# Altium schematic sheet PCB Ver. 1.0.SchDoc
size A3; PageSetup: Record=PageOptions|CenterHorizontal=True|CenterVertical=True|PrintScale=1.00|XCorrection=1.00|YCorrection=1.00|PrintKind=1|BorderSize=5000000|LeftOffset=0|BottomOffset=0|Orientation=2|PaperLength=1000|PaperWidth=1000|Scale=100|PaperSource=7|PrintQuality=-3|MediaType=1|DitherType=10|PrintScaleMode=1|PaperKind=A3|PaperIndex=8
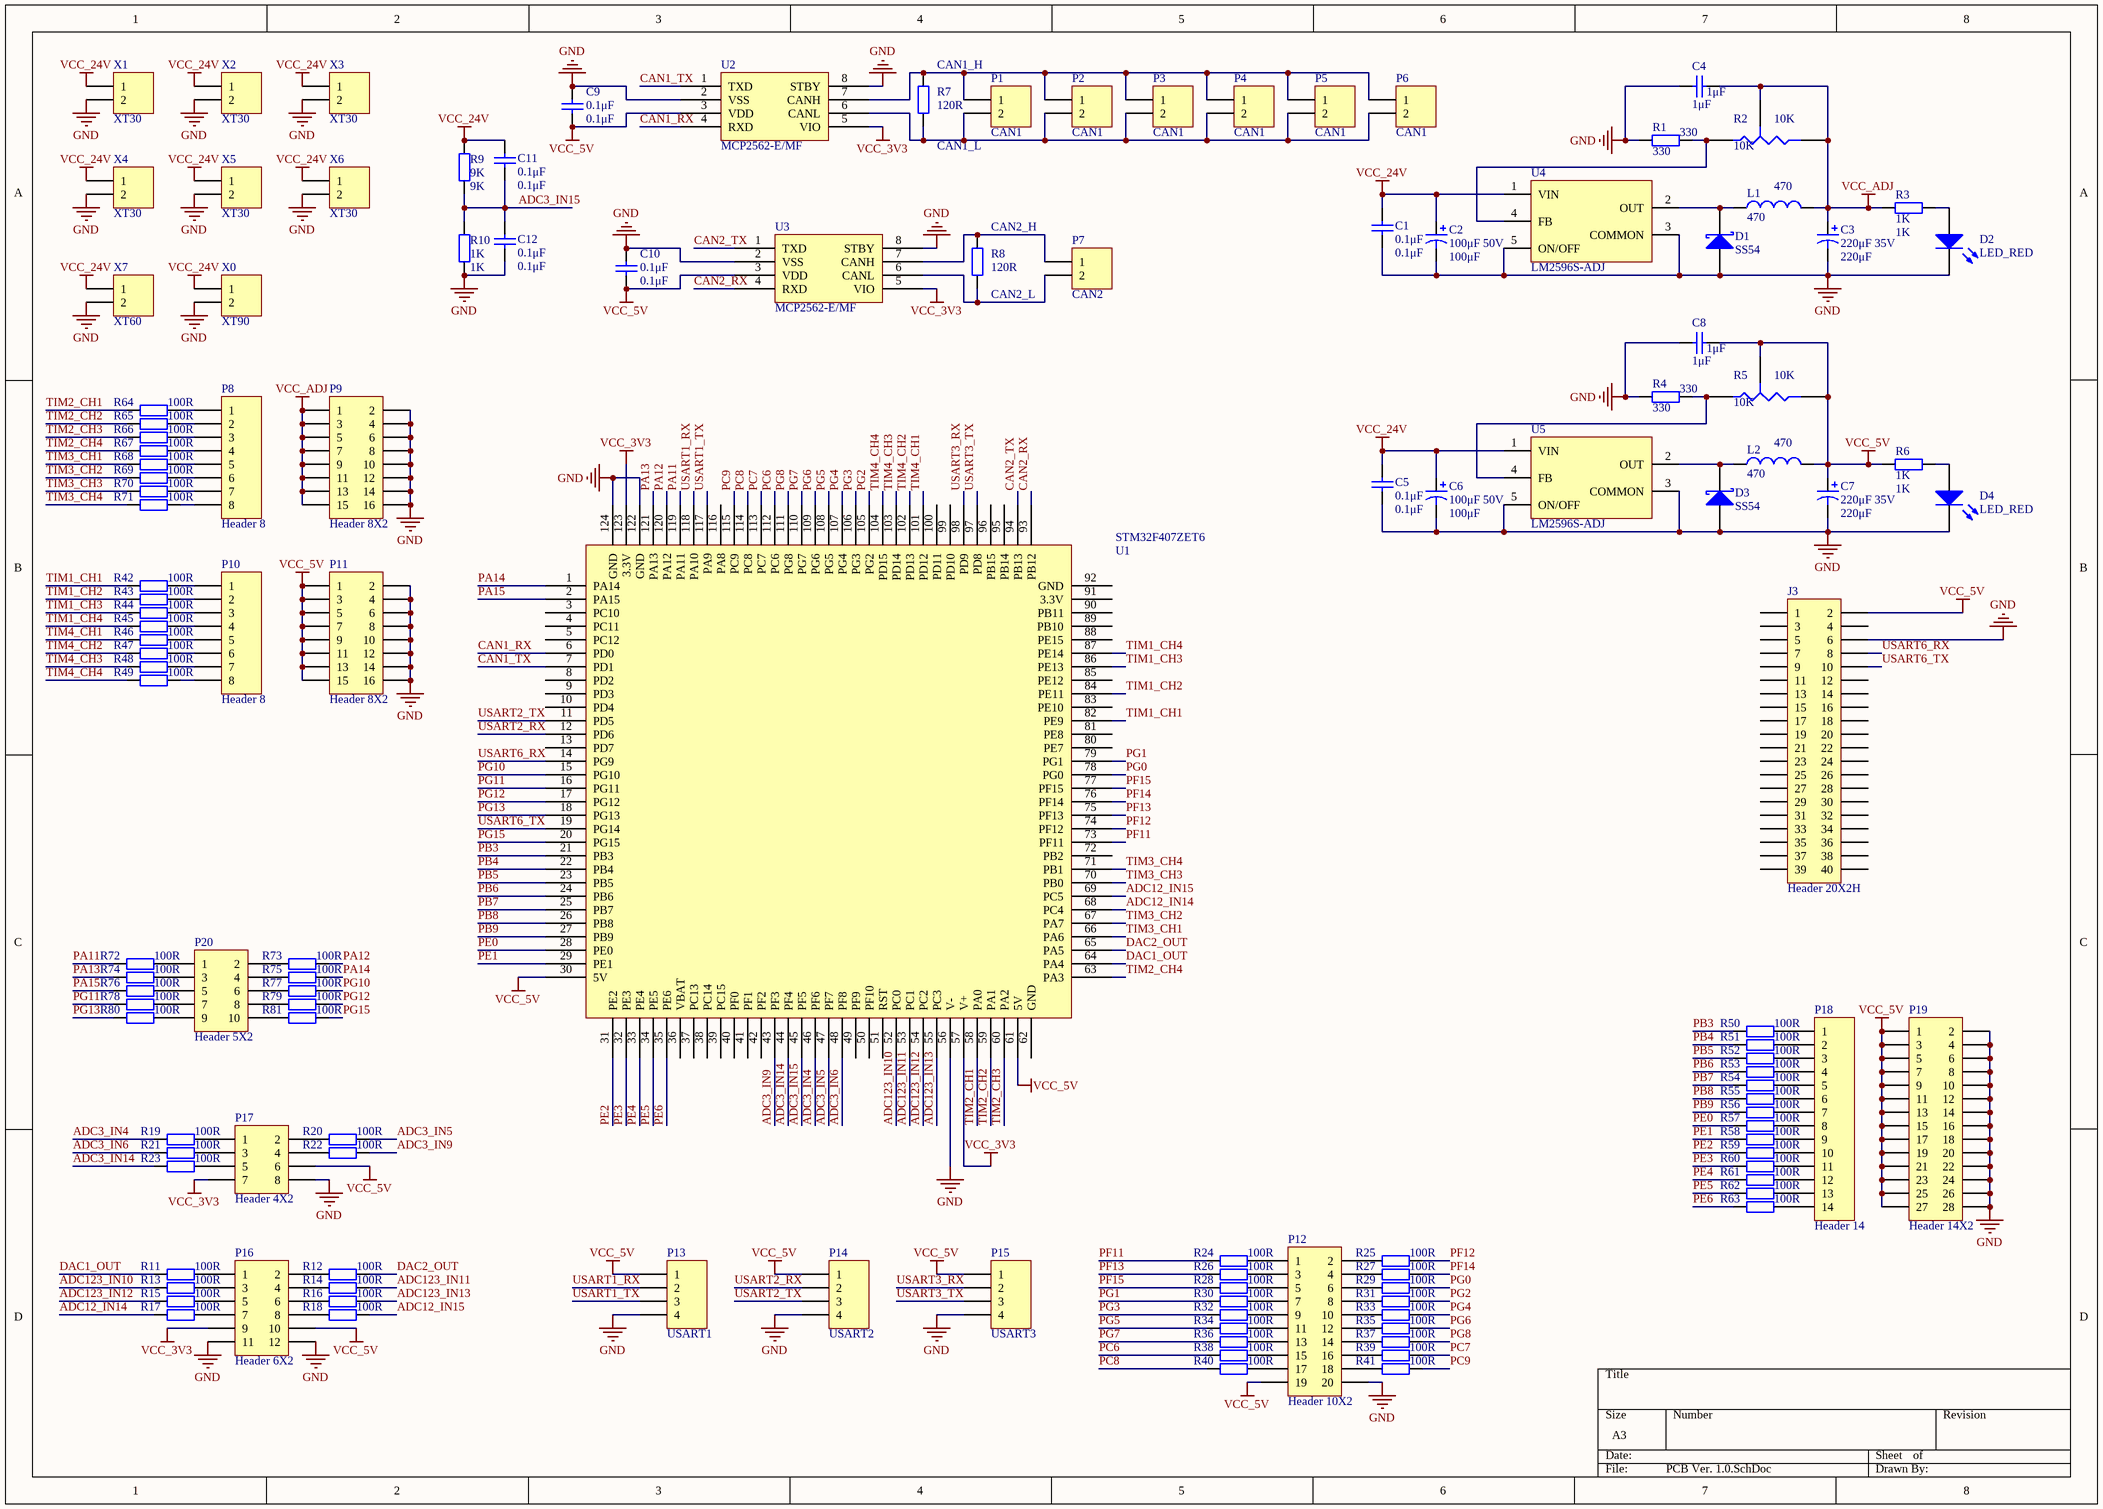
[diagram p0: PCB Ver. 1.0.SchDoc]

## Parts
C1  0.1μF  [6-0805_N]
C2  100μF 50V  value 100μF  [8*12直插铝电解]
C3  220μF 35V  value 220μF  [8*12直插铝电解]
C4  1μF  [6-0805_N]
C5  0.1μF  [6-0805_N]
C6  100μF 50V  value 100μF  [8*12直插铝电解]
C7  220μF 35V  value 220μF  [8*12直插铝电解]
C8  1μF  [6-0805_N]
C9  0.1μF  [6-0805_N]
C10  0.1μF  [6-0805_N]
C11  0.1μF  [6-0805_N]
C12  0.1μF  [6-0805_N]
D1  SS54  [DO-214AA]
D2  LED_RED  [1206_LED]
D3  SS54  [DO-214AA]
D4  LED_RED  [1206_LED]
J3  Header 20X2H  [HDR2X20]
L1  470  [12*12*7贴片电感]
L2  470  [12*12*7贴片电感]
P1  CAN1  [MHDR1X2]
P2  CAN1  [MHDR1X2]
P3  CAN1  [MHDR1X2]
P4  CAN1  [MHDR1X2]
P5  CAN1  [MHDR1X2]
P6  CAN1  [MHDR1X2]
P7  CAN2  [HDR1X2]
P8  Header 8  [HDR1X8]
P9  Header 8X2  [HDR2X8]
P10  Header 8  [HDR1X8]
P11  Header 8X2  [HDR2X8]
P12  Header 10X2  [HDR2X10]
P13  USART1  [HDR1X4]
P14  USART2  [HDR1X4]
P15  USART3  [HDR1X4]
P16  Header 6X2  [HDR2X6]
P17  Header 4X2  [HDR2X4]
P18  Header 14  [HDR1X14]
P19  Header 14X2  [HDR2X14]
P20  Header 5X2  [HDR2X5]
R1  330  [6-0805_N]
R2  10K  [3296W精密电位器]
R3  1K  [6-0805_N]
R4  330  [6-0805_N]
R5  10K  [3296W精密电位器]
R6  1K  [6-0805_N]
R7  120R  [6-0805_N]
R8  120R  [6-0805_N]
R9  9K  [6-0805_N]
R10  1K  [6-0805_N]
R11  100R  [6-0805_N]
R12  100R  [6-0805_N]
R13  100R  [6-0805_N]
R14  100R  [6-0805_N]
R15  100R  [6-0805_N]
R16  100R  [6-0805_N]
R17  100R  [6-0805_N]
R18  100R  [6-0805_N]
R19  100R  [6-0805_N]
R20  100R  [6-0805_N]
R21  100R  [6-0805_N]
R22  100R  [6-0805_N]
R23  100R  [6-0805_N]
R24  100R  [6-0805_N]
R25  100R  [6-0805_N]
R26  100R  [6-0805_N]
R27  100R  [6-0805_N]
R28  100R  [6-0805_N]
R29  100R  [6-0805_N]
R30  100R  [6-0805_N]
R31  100R  [6-0805_N]
R32  100R  [6-0805_N]
R33  100R  [6-0805_N]
R34  100R  [6-0805_N]
R35  100R  [6-0805_N]
R36  100R  [6-0805_N]
R37  100R  [6-0805_N]
R38  100R  [6-0805_N]
R39  100R  [6-0805_N]
R40  100R  [6-0805_N]
R41  100R  [6-0805_N]
R42  100R  [6-0805_N]
R43  100R  [6-0805_N]
R44  100R  [6-0805_N]
R45  100R  [6-0805_N]
R46  100R  [6-0805_N]
R47  100R  [6-0805_N]
R48  100R  [6-0805_N]
R49  100R  [6-0805_N]
R50  100R  [6-0805_N]
R51  100R  [6-0805_N]
R52  100R  [6-0805_N]
R53  100R  [6-0805_N]
R54  100R  [6-0805_N]
R55  100R  [6-0805_N]
R56  100R  [6-0805_N]
R57  100R  [6-0805_N]
R58  100R  [6-0805_N]
R59  100R  [6-0805_N]
R60  100R  [6-0805_N]
R61  100R  [6-0805_N]
R62  100R  [6-0805_N]
R63  100R  [6-0805_N]
R64  100R  [6-0805_N]
R65  100R  [6-0805_N]
R66  100R  [6-0805_N]
R67  100R  [6-0805_N]
R68  100R  [6-0805_N]
R69  100R  [6-0805_N]
R70  100R  [6-0805_N]
R71  100R  [6-0805_N]
R72  100R  [6-0805_N]
R73  100R  [6-0805_N]
R74  100R  [6-0805_N]
R75  100R  [6-0805_N]
R76  100R  [6-0805_N]
R77  100R  [6-0805_N]
R78  100R  [6-0805_N]
R79  100R  [6-0805_N]
R80  100R  [6-0805_N]
R81  100R  [6-0805_N]
STM32F407ZET6  U1  [STM32F103ZET6]
U2  MCP2562-E/MF  [SO-8]
U3  MCP2562-E/MF  [SO-8]
U4  LM2596S-ADJ  [TO-263]
U5  LM2596S-ADJ  [TO-263]
X0  XT90  [XT90PB]
X1  XT30  [XT30UPB]
X2  XT30  [XT30UPB]
X3  XT30  [XT30UPB]
X4  XT30  [XT30UPB]
X5  XT30  [XT30UPB]
X6  XT30  [XT30UPB]
X7  XT60  [XT60PB]

## Nets
GND: C1.1 C2.2 C3.2 C4.1 C5.1 C6.2 C7.2 C8.1 C9.2 C10.2 C12.1 D1.1(A) D2.2(K) D3.1(A) D4.2(K) J3.6 P9.2 P9.4 P9.6 P9.8 P9.10 P9.12 P9.14 P9.16 P11.2 P11.4 P11.6 P11.8 P11.10 P11.12 P11.14 P11.16 P12.20 P13.4 P14.4 P15.4 P16.11 P16.12 P17.8 P19.2 P19.4 P19.6 P19.8 P19.10 P19.12 P19.14 P19.16 P19.18 P19.20 P19.22 P19.24 P19.26 P19.28 R1.1 R4.1 R10.1 STM32F407ZET6.56(V-) STM32F407ZET6.122(GND) STM32F407ZET6.124(GND) U2.2(VSS) U2.8(STBY) U3.2(VSS) U3.8(STBY) U4.3(COMMON) U4.5(ON/OFF) U5.3(COMMON) U5.5(ON/OFF) X0.2 X1.2 X2.2 X3.2 X4.2 X5.2 X6.2 X7.2
VCC_3V3: P16.9 P17.7 STM32F407ZET6.57(V+) STM32F407ZET6.123(3.3V) U2.5(VIO) U3.5(VIO)
VCC_5V: C7.1 C8.2 C9.1 C10.1 J3.2 L2.2 P11.1 P11.3 P11.5 P11.7 P11.9 P11.11 P11.13 P11.15 P12.19 P13.1 P14.1 P15.1 P16.10 P17.6 P19.1 P19.3 P19.5 P19.7 P19.9 P19.11 P19.13 P19.15 P19.17 P19.19 P19.21 P19.23 P19.25 P19.27 R5.2(B) R5.3(TAP) R6.1 STM32F407ZET6.30(5V) STM32F407ZET6.61(5V) U2.3(VDD) U3.3(VDD)
VCC_24V: C1.2 C2.1 C5.2 C6.1 C11.2 R9.2 U4.1(VIN) U5.1(VIN) X0.1 X1.1 X2.1 X3.1 X4.1 X5.1 X6.1 X7.1
VCC_ADJ: C3.1 C4.2 L1.2 P9.1 P9.3 P9.5 P9.7 P9.9 P9.11 P9.13 P9.15 R2.2(B) R2.3(TAP) R3.1
ADC3_IN4: R19.1 STM32F407ZET6.46(PF6)
ADC3_IN5: R20.2 STM32F407ZET6.47(PF7)
ADC3_IN6: R21.1 STM32F407ZET6.48(PF8)
ADC3_IN9: R22.2 STM32F407ZET6.43(PF3)
ADC3_IN14: R23.1 STM32F407ZET6.44(PF4)
ADC3_IN15: C11.1 C12.2 R9.1 R10.2 STM32F407ZET6.45(PF5)
ADC12_IN14: R17.1 STM32F407ZET6.68(PC4)
ADC12_IN15: R18.2 STM32F407ZET6.69(PC5)
ADC123_IN10: R13.1 STM32F407ZET6.52(PC0)
ADC123_IN11: R14.2 STM32F407ZET6.53(PC1)
ADC123_IN12: R15.1 STM32F407ZET6.54(PC2)
ADC123_IN13: R16.2 STM32F407ZET6.55(PC3)
CAN1_RX: STM32F407ZET6.6(PD0) U2.4(RXD)
CAN1_TX: STM32F407ZET6.7(PD1) U2.1(TXD)
CAN2_RX: STM32F407ZET6.93(PB12) U3.4(RXD)
CAN2_TX: STM32F407ZET6.94(PB13) U3.1(TXD)
DAC1_OUT: R11.1 STM32F407ZET6.64(PA4)
DAC2_OUT: R12.2 STM32F407ZET6.65(PA5)
PA11: R72.1 STM32F407ZET6.119(PA11)
PA12: R73.2 STM32F407ZET6.120(PA12)
PA13: R74.1 STM32F407ZET6.121(PA13)
PA14: R75.2 STM32F407ZET6.1(PA14)
PA15: R76.1 STM32F407ZET6.2(PA15)
PB3: R50.1 STM32F407ZET6.21(PB3)
PB4: R51.1 STM32F407ZET6.22(PB4)
PB5: R52.1 STM32F407ZET6.23(PB5)
PB6: R53.1 STM32F407ZET6.24(PB6)
PB7: R54.1 STM32F407ZET6.25(PB7)
PB8: R55.1 STM32F407ZET6.26(PB8)
PB9: R56.1 STM32F407ZET6.27(PB9)
PC6: R38.1 STM32F407ZET6.112(PC6)
PC7: R39.2 STM32F407ZET6.113(PC7)
PC8: R40.1 STM32F407ZET6.114(PC8)
PC9: R41.2 STM32F407ZET6.115(PC9)
PE0: R57.1 STM32F407ZET6.28(PE0)
PE1: R58.1 STM32F407ZET6.29(PE1)
PE2: R59.1 STM32F407ZET6.31(PE2)
PE3: R60.1 STM32F407ZET6.32(PE3)
PE4: R61.1 STM32F407ZET6.33(PE4)
PE5: R62.1 STM32F407ZET6.34(PE5)
PE6: R63.1 STM32F407ZET6.35(PE6)
PF11: R24.1 STM32F407ZET6.73(PF11)
PF12: R25.2 STM32F407ZET6.74(PF12)
PF13: R26.1 STM32F407ZET6.75(PF13)
PF14: R27.2 STM32F407ZET6.76(PF14)
PF15: R28.1 STM32F407ZET6.77(PF15)
PG0: R29.2 STM32F407ZET6.78(PG0)
PG1: R30.1 STM32F407ZET6.79(PG1)
PG2: R31.2 STM32F407ZET6.105(PG2)
PG3: R32.1 STM32F407ZET6.106(PG3)
PG4: R33.2 STM32F407ZET6.107(PG4)
PG5: R34.1 STM32F407ZET6.108(PG5)
PG6: R35.2 STM32F407ZET6.109(PG6)
PG7: R36.1 STM32F407ZET6.110(PG7)
PG8: R37.2 STM32F407ZET6.111(PG8)
PG10: R77.2 STM32F407ZET6.15(PG10)
PG11: R78.1 STM32F407ZET6.16(PG11)
PG12: R79.2 STM32F407ZET6.17(PG12)
PG13: R80.1 STM32F407ZET6.18(PG13)
PG15: R81.2 STM32F407ZET6.20(PG15)
TIM1_CH1: R42.1 STM32F407ZET6.82(PE9)
TIM1_CH2: R43.1 STM32F407ZET6.84(PE11)
TIM1_CH3: R44.1 STM32F407ZET6.86(PE13)
TIM1_CH4: R45.1 STM32F407ZET6.87(PE14)
TIM2_CH1: R64.1 STM32F407ZET6.58(PA0)
TIM2_CH2: R65.1 STM32F407ZET6.59(PA1)
TIM2_CH3: R66.1 STM32F407ZET6.60(PA2)
TIM2_CH4: R67.1 STM32F407ZET6.63(PA3)
TIM3_CH1: R68.1 STM32F407ZET6.66(PA6)
TIM3_CH2: R69.1 STM32F407ZET6.67(PA7)
TIM3_CH3: R70.1 STM32F407ZET6.70(PB0)
TIM3_CH4: R71.1 STM32F407ZET6.71(PB1)
TIM4_CH1: R46.1 STM32F407ZET6.101(PD12)
TIM4_CH2: R47.1 STM32F407ZET6.102(PD13)
TIM4_CH3: R48.1 STM32F407ZET6.103(PD14)
TIM4_CH4: R49.1 STM32F407ZET6.104(PD15)
USART1_RX: P13.2 STM32F407ZET6.118(PA10)
USART1_TX: P13.3 STM32F407ZET6.117(PA9)
USART2_RX: P14.2 STM32F407ZET6.12(PD6)
USART2_TX: P14.3 STM32F407ZET6.11(PD5)
USART3_RX: P15.2 STM32F407ZET6.98(PD9)
USART3_TX: P15.3 STM32F407ZET6.97(PD8)
USART6_RX: J3.8 STM32F407ZET6.14(PG9)
USART6_TX: J3.10 STM32F407ZET6.19(PG14)
NetD1_2: D1.2(K) L1.1 U4.2(OUT)
NetD2_1: D2.1(A) R3.2
NetD3_2: D3.2(K) L2.1 U5.2(OUT)
NetD4_1: D4.1(A) R6.2
NetP1_1: P1.1 P2.1 P3.1 P4.1 P5.1 P6.1 R7.2 U2.7(CANH)
NetP1_2: P1.2 P2.2 P3.2 P4.2 P5.2 P6.2 R7.1 U2.6(CANL)
NetP7_1: P7.1 R8.2 U3.7(CANH)
NetP7_2: P7.2 R8.1 U3.6(CANL)
NetP8_1: P8.1 R64.2
NetP8_2: P8.2 R65.2
NetP8_3: P8.3 R66.2
NetP8_4: P8.4 R67.2
NetP8_5: P8.5 R68.2
NetP8_6: P8.6 R69.2
NetP8_7: P8.7 R70.2
NetP8_8: P8.8 R71.2
NetP10_1: P10.1 R42.2
NetP10_2: P10.2 R43.2
NetP10_3: P10.3 R44.2
NetP10_4: P10.4 R45.2
NetP10_5: P10.5 R46.2
NetP10_6: P10.6 R47.2
NetP10_7: P10.7 R48.2
NetP10_8: P10.8 R49.2
NetP12_1: P12.1 R24.2
NetP12_2: P12.2 R25.1
NetP12_3: P12.3 R26.2
NetP12_4: P12.4 R27.1
NetP12_5: P12.5 R28.2
NetP12_6: P12.6 R29.1
NetP12_7: P12.7 R30.2
NetP12_8: P12.8 R31.1
NetP12_9: P12.9 R32.2
NetP12_10: P12.10 R33.1
NetP12_11: P12.11 R34.2
NetP12_12: P12.12 R35.1
NetP12_13: P12.13 R36.2
NetP12_14: P12.14 R37.1
NetP12_15: P12.15 R38.2
NetP12_16: P12.16 R39.1
NetP12_17: P12.17 R40.2
NetP12_18: P12.18 R41.1
NetP16_1: P16.1 R11.2
NetP16_2: P16.2 R12.1
NetP16_3: P16.3 R13.2
NetP16_4: P16.4 R14.1
NetP16_5: P16.5 R15.2
NetP16_6: P16.6 R16.1
NetP16_7: P16.7 R17.2
NetP16_8: P16.8 R18.1
NetP17_1: P17.1 R19.2
NetP17_2: P17.2 R20.1
NetP17_3: P17.3 R21.2
NetP17_4: P17.4 R22.1
NetP17_5: P17.5 R23.2
NetP18_1: P18.1 R50.2
NetP18_2: P18.2 R51.2
NetP18_3: P18.3 R52.2
NetP18_4: P18.4 R53.2
NetP18_5: P18.5 R54.2
NetP18_6: P18.6 R55.2
NetP18_7: P18.7 R56.2
NetP18_8: P18.8 R57.2
NetP18_9: P18.9 R58.2
NetP18_10: P18.10 R59.2
NetP18_11: P18.11 R60.2
NetP18_12: P18.12 R61.2
NetP18_13: P18.13 R62.2
NetP18_14: P18.14 R63.2
NetP20_1: P20.1 R72.2
NetP20_2: P20.2 R73.1
NetP20_3: P20.3 R74.2
NetP20_4: P20.4 R75.1
NetP20_5: P20.5 R76.2
NetP20_6: P20.6 R77.1
NetP20_7: P20.7 R78.2
NetP20_8: P20.8 R79.1
NetP20_9: P20.9 R80.2
NetP20_10: P20.10 R81.1
NetR1_2: R1.2 R2.1(A) U4.4(FB)
NetR4_2: R4.2 R5.1(A) U5.4(FB)

Not connected (* = marked no-connect by the designer): J3 1 3 4 5 7 9 11 12 13 14 15 16 17 18 19 20 21 22 23 24 25 26 27 28 29 30 31 32 33 34 35 36 37 38 39 40; STM32F407ZET6 3(PC10) 4(PC11) 5(PC12) 8(PD2) 9(PD3) 10(PD4) 13(PD7) 36(VBAT) 37(PC13) 38(PC14) 39(PC15) 40(PF0) 41(PF1) 42(PF2) 49(PF9) 50(PF10) 51(RST) 62(GND) 72(PB2) 80(PE7) 81(PE8) 83(PE10) 85(PE12) 88(PE15) 89(PB10) 90(PB11) 91(3.3V) 92(GND) 95(PB14) 96(PB15) 99(PD10) 100(PD11) 116(PA8)

## Notes on the sheet
- CAN1_H
- CAN1_L
- (near R8) CAN2_H
- (near R8) CAN2_L

## Library data of the parts
C1 C4 C5 C8-C12 = Cap: Capacitor; Published: 8-Jun-2000; LatestRevisionDate: 17-Jul-2002; LatestRevisionNote: Re-released for DXP Platform.; PackageReference: RAD-0.3; Publisher: Altium Limited; PackageDescription: Radial Cap, Thru-Hole; 2 Leads; 0.3 in Pin Spacing
  C1 C5 C9-C12: Value: 0.1μF
  C4 C8: Value: 1μF
C2 C3 C6 C7 = Cap Pol1: Polarized Capacitor (Radial); Published: 8-Jun-2000; LatestRevisionDate: 17-Jul-2002; LatestRevisionNote: Re-released for DXP Platform.; PackageReference: RB7.6-15; Publisher: Altium Limited; PackageDescription: Polarized Capacitor (Radial); 2 Leads
D1 D3 = Diode 11DQ03: Schottky Rectifier; Published: 8-Jun-2000; LatestRevisionDate: 17-Jul-2002; LatestRevisionNote: Re-released for DXP Platform.; DatasheetVersion: Dec-1997; PackageReference: DO-204AL; Publisher: Altium Limited; PackageDescription: Diode, Axial; Body 5.2 x 2.7 mm (LxDia. max), Lead Dia. 0.86 mm (max); Code_JEDEC: DO-204-AL; ComponentLink1Description: Manufacturer Link; ComponentLink1URL: http://www.irf.com/; ComponentLink2Description: Datasheet; ComponentLink2URL: http://www.irf.com/product-info/datasheets/data/11dq03.pdf
D2 D4 = LED3: Typical BLUE SiC LED; Published: 8-Jun-2000; LatestRevisionDate: 17-Dec-2003; LatestRevisionNote: PCB Footprint replaced.; DatasheetVersion: 16-Apr-2002; PackageVersion: 16-Apr-2002; PackageReference: 3.5X2.8X1.9; Publisher: Altium Limited; PackageDescription: SM LED; 2 C-Bend Leads; Body 3.5 x 2.8 x 1.9 mm, inc leads (LxWxH typ)
J3 = Header 20X2H: Header, 20-Pin, Dual row, Right Angle; LatestRevisionDate: 17-Jul-2002; LatestRevisionNote: Re-released for DXP Platform.; Publisher: Altium Limited
L1 L2 = Inductor: Code_IEC: 1005; Published: 8-Jun-2000; LatestRevisionDate: 29-May-2009; LatestRevisionNote: IPC-7351 Footprint Added.; PackageReference: 0402-A; Publisher: Altium Limited; PackageDescription: Chip Inductor; Code_JEITA: 0402; Value: 470
P1-P7 X0-X7 = Header 2: Header, 2-Pin; LatestRevisionDate: 17-Jul-2002; LatestRevisionNote: Re-released for DXP Platform.; Publisher: Altium Limited
P8 P10 = Header 8: Header, 8-Pin; LatestRevisionDate: 17-Jul-2002; LatestRevisionNote: Re-released for DXP Platform.; Publisher: Altium Limited
P9 P11 = Header 8X2: Header, 8-Pin, Dual row; LatestRevisionDate: 17-Jul-2002; LatestRevisionNote: Re-released for DXP Platform.; Publisher: Altium Limited
P12 = Header 10X2: Header, 10-Pin, Dual row; LatestRevisionDate: 17-Jul-2002; LatestRevisionNote: Re-released for DXP Platform.; Publisher: Altium Limited
P13-P15 = Header 4: Header, 4-Pin; LatestRevisionDate: 17-Jul-2002; LatestRevisionNote: Re-released for DXP Platform.; Publisher: Altium Limited
P16 = Header 6X2: Header, 6-Pin, Dual row; LatestRevisionDate: 17-Jul-2002; LatestRevisionNote: Re-released for DXP Platform.; Publisher: Altium Limited
P17 = Header 4X2: Header, 4-Pin, Dual row; LatestRevisionDate: 17-Jul-2002; LatestRevisionNote: Re-released for DXP Platform.; Publisher: Altium Limited
P18 = Header 14: Header, 14-Pin; LatestRevisionDate: 17-Jul-2002; LatestRevisionNote: Re-released for DXP Platform.; Publisher: Altium Limited
P19 = Header 14X2: Header, 14-Pin, Dual row; LatestRevisionDate: 17-Jul-2002; LatestRevisionNote: Re-released for DXP Platform.; Publisher: Altium Limited
P20 = Header 5X2: Header, 5-Pin, Dual row; LatestRevisionDate: 17-Jul-2002; LatestRevisionNote: Re-released for DXP Platform.; Publisher: Altium Limited
R1 R3 R4 R6-R81 = Res2: Resistor; Published: 8-Jun-2000; LatestRevisionDate: 17-Jul-2002; LatestRevisionNote: Re-released for DXP Platform.; PackageReference: AXIAL-0.4; Publisher: Altium Limited; PackageDescription: Axial Device, Thru-Hole; 2 Leads; 0.4 in Pin Spacing
  R1 R4: Value: 330
  R3 R6 R10: Value: 1K
  R7 R8: Value: 120R
  R9: Value: 9K
  R11-R81: Value: 100R
R2 R5 = Res Tap: Tapped Resistor; Sim Note: Enter the Resistance value and the set point into parameter fields.; Set Position: 0.5; Published: 24-Mar-1999; LatestRevisionDate: 17-Jul-2002; LatestRevisionNote: Re-released for DXP Platform.; PackageReference: VR3; Publisher: Altium Limited; PackageDescription: Variable Resistor, Thru-Hole; 3 Leads; Value: 10K
STM32F407ZET6 = Component_1
U4 U5 = LM2576S-5.0: CI-LM2576S-5.0